# EAGLE design Eagle_Teensy3_6_TAF_BoardV2.2 (EAGLE 8.3.2)
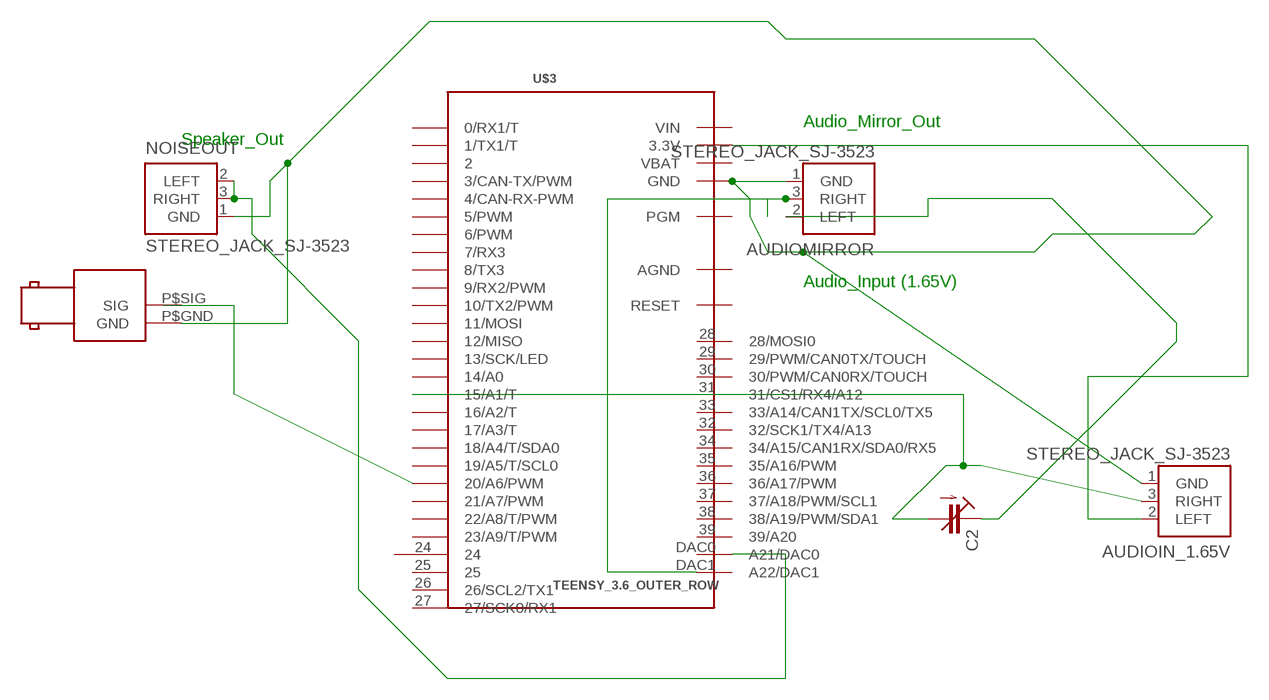
[diagram p0: schematic, sheet 1]

## Parts
AUDIOIN_1.65V  STEREO_JACK_SJ-3523  [SJ-3523]
AUDIOMIRROR  STEREO_JACK_SJ-3523  [SJ-3523]
C2  C-TRIMM3008  [3008]
NOISEOUT  STEREO_JACK_SJ-3523  [SJ-3523]
TTL  BNC_RIGHT_ANGLE  [BNC_RIGHT_ANGLE]
U$3  TEENSY_3.6_OUTER_ROW  [TEENSY3_6-OUTER_ROW]

## Nets
N$1: NOISEOUT.2(LEFT) NOISEOUT.3(RIGHT)
N$2: AUDIOIN_1.65V.1(GND) AUDIOMIRROR.1(GND) NOISEOUT.1(GND) TTL.P$GND(GND) U$3.3.3V2(GND) U$3.GND U$3.GND1(GND) U$3.GND2(GND)
N$3: AUDIOIN_1.65V.2(LEFT) U$3.3.3V U$3.3.3V1(3.3V)
N$5: AUDIOIN_1.65V.3(RIGHT) C2.-(A) U$3.15/A1(15/A1/T)
N$6: AUDIOMIRROR.3(RIGHT) U$3.DAC1(A22/DAC1)
N$8: AUDIOMIRROR.2(LEFT) C2.+(E)
Unconnected: TTL.P$SIG(SIG) U$3.0(0/RX1/T) U$3.1(1/TX1/T) U$3.2 U$3.3(3/CAN-TX/PWM) U$3.4(4/CAN-RX-PWM) U$3.5(5/PWM) U$3.6(6/PWM) U$3.7(7/RX3) U$3.8(8/TX3) U$3.9(9/RX2/PWM) U$3.10(10/TX2/PWM) U$3.11(11/MOSI) U$3.12(12/MISO) U$3.13(13/SCK/LED) U$3.14/A0 U$3.16/A2(16/A2/T) U$3.17/A3(17/A3/T) U$3.18/A4(18/A4/T/SDA0) U$3.19/A5(19/A5/T/SCL0) U$3.20/A6(20/A6/PWM) U$3.21/A7(21/A7/PWM) U$3.22/A8(22/A8/T/PWM) U$3.23/A9(23/A9/T/PWM) U$3.24 U$3.25 U$3.26(26/SCL2/TX1) U$3.27(27/SCK0/RX1) U$3.28(28/MOSI0) U$3.29(29/PWM/CAN0TX/TOUCH) U$3.30(30/PWM/CAN0RX/TOUCH) U$3.31(31/CS1/RX4/A12) U$3.32(32/SCK1/TX4/A13) U$3.33(33/A14/CAN1TX/SCL0/TX5) U$3.34(34/A15/CAN1RX/SDA0/RX5) U$3.35(35/A16/PWM) U$3.36(36/A17/PWM) U$3.37(37/A18/PWM/SCL1) U$3.38(38/A19/PWM/SDA1) U$3.39(39/A20) U$3.DAC0(A21/DAC0) U$3.PGM U$3.RESET

## Notes on the sheet
- Audio_Mirror_Out
- Speaker_Out
- Audio_Input (1.65V)

## Power pins joined to a net without a drawn wire
AGND: U$3.AGND
VBAT: U$3.VBAT
VIN: U$3.VIN

## Library data of the parts
AUDIOIN_1.65V AUDIOMIRROR NOISEOUT = RHD2000_eval_board:STEREO_JACK: CUI Inc. SJ-3523 stereo audio jack
C2 = c-trimm:C-TRIMM: Trimm capacitor; OC_FARNELL: unknown; OC_NEWARK: unknown
TTL = connectors:BNC_RIGHT_ANGLE: BNC plug, through-hole, right-angle
U$3 = Teensy3_6:TEENSY_3.6_OUTER_ROW: Footprint for Teensy 3.1 or 3.2 board using all pin connections on the outer perimeter

## Board
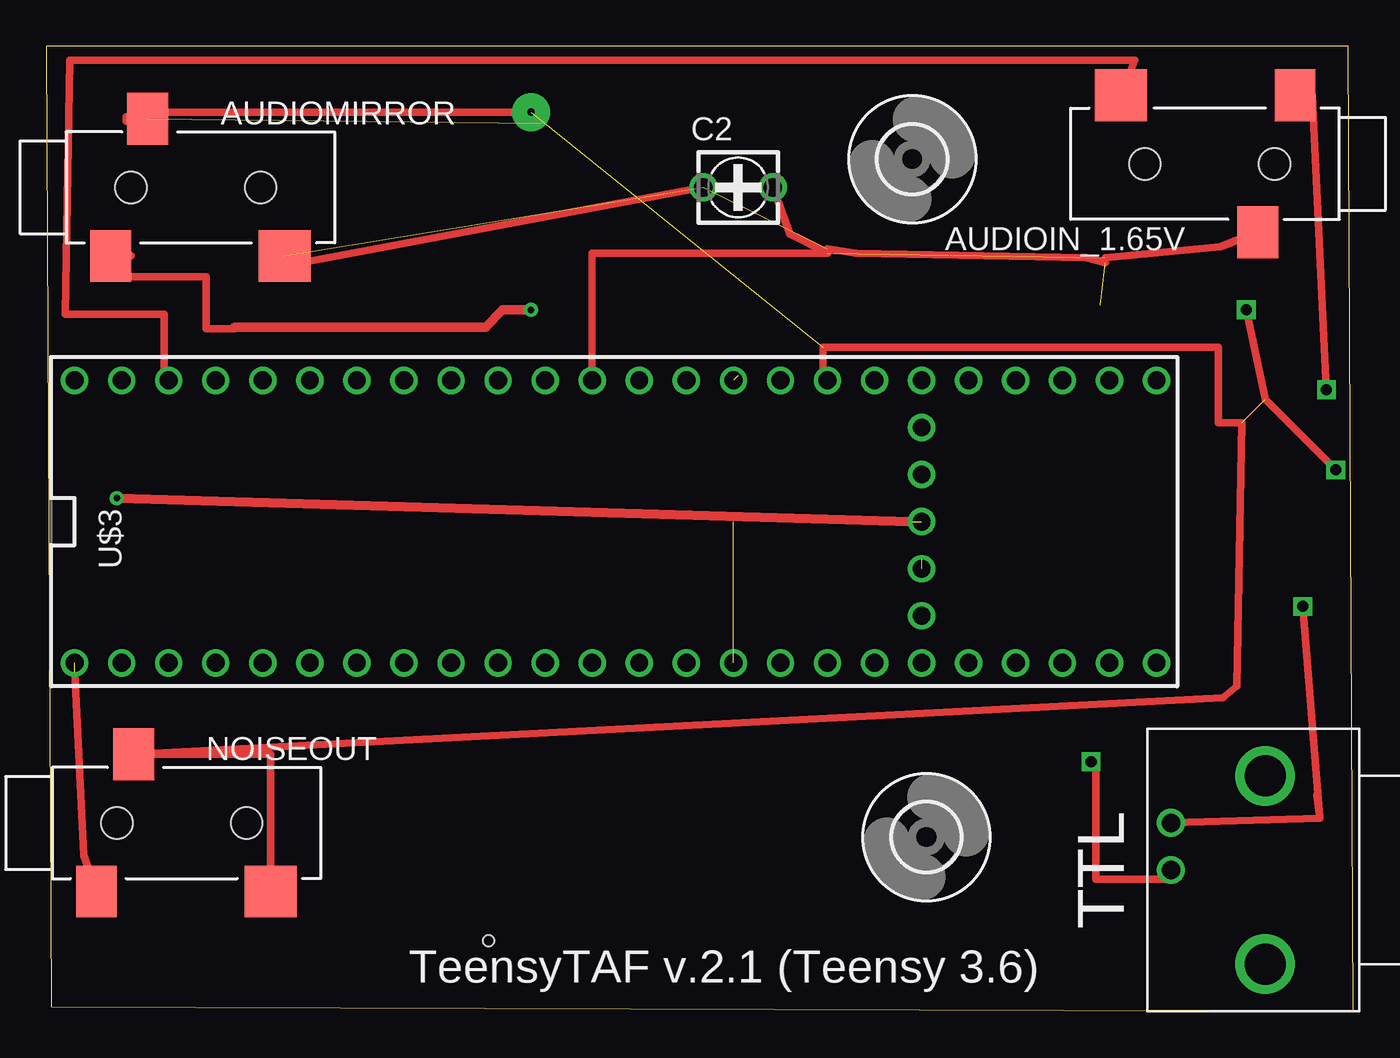
[diagram p1: board, top side]
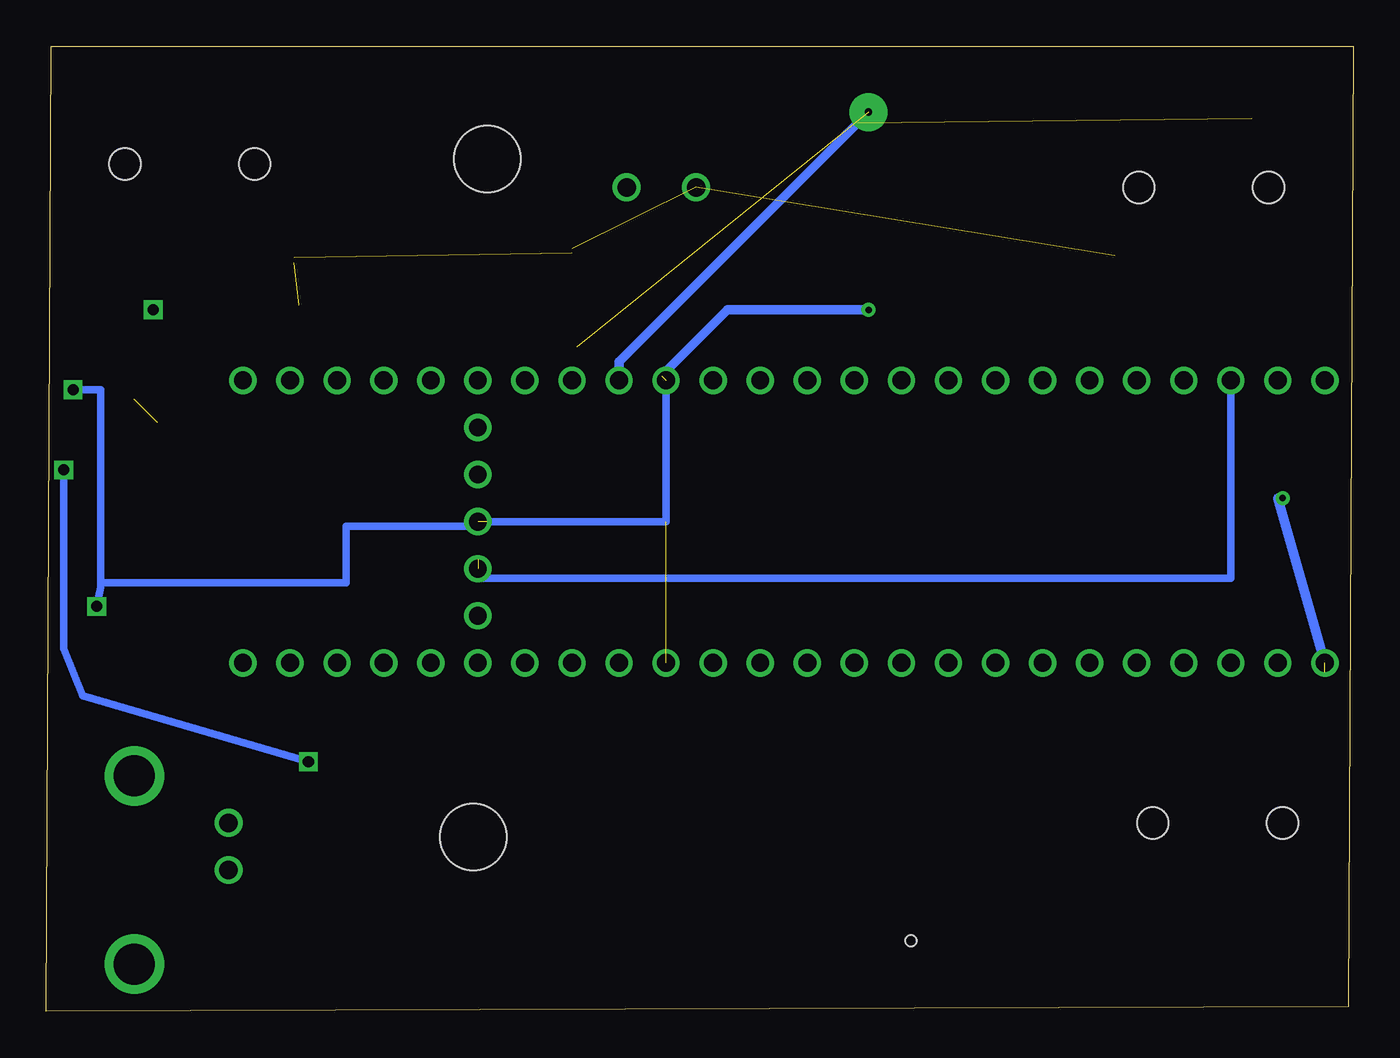
[diagram p2: board, bottom side, seen from below]

Size 70.54 x 52.06 mm. Coordinates in mm from the lower left corner, seen from the top.
Outline: 0.25,0.25 70.54,0 70.28,52.06 0,52.06 0.25,0.25
Copper layers (1*16): Top 0.035mm / dielectric 1.5mm / Bottom 0.035mm
Design rules "default": minimum track width 10mil, minimum drill 24mil, track to track 8mil, track to pad 8mil, pad to pad 8mil, via to via 8mil, smd to smd 8mil, copper to edge 40mil, drill to drill 8mil, minimum pad ring 10mil, minimum via ring 8mil, stop-mask expansion 4mil, vias tented up to drill 0mil, thermal gap 10mil
Holes 0.6 mm at 23.88,3.81 23.88,3.81 23.88,3.81

### Footprints (pad centres in the part's own frame; a part is rotated, then mirrored left to right if it is on the bottom)
SJ-3523 = smd 2.2 x 2.8: 1 -1.1,-3.7; 3 0.9,3.7 | smd 2.8 x 2.8: 2 8.3,-3.7 | hole 1.7: 7,0; 0,0
3008 = drill 1: + -1.875,0; - 1.875,0
BNC_RIGHT_ANGLE = drill 2.2: P$1 -5.08,-6.35; P$2 5.08,-6.35 | drill 1: P$GND -2.54,-11.43; P$SIG 0,-11.43
3,6 = hole 3.6: 0,0
TEENSY3_6-OUTER_ROW = drill 0.965: 0 -7.62,13.97; 1 -7.62,11.43; 2 -7.62,8.89; 3 -7.62,6.35; 3.3V 7.62,11.43; 3.3V1 -2.54,-29.21; 3.3V2 -7.62,-19.05; 4 -7.62,3.81; 5 -7.62,1.27; 6 -7.62,-1.27; 7 -7.62,-3.81; 8 -7.62,-6.35; 9 -7.62,-8.89; 10 -7.62,-11.43; 11 -7.62,-13.97; 12 -7.62,-16.51; 13 7.62,-16.51; 14/A0 7.62,-13.97; 15/A1 7.62,-11.43; 16/A2 7.62,-8.89; 17/A3 7.62,-6.35; 18/A4 7.62,-3.81; 19/A5 7.62,-1.27; 20/A6 7.62,1.27; 21/A7 7.62,3.81; 22/A8 7.62,6.35; 23/A9 7.62,8.89; 24 -7.62,-21.59; 25 -7.62,-24.13; 26 -7.62,-26.67; 27 -7.62,-29.21; 28 -7.62,-31.75; 29 -7.62,-34.29; 30 -7.62,-36.81; 31 -7.62,-39.35; 32 -7.62,-41.89; 33 7.62,-41.89; 34 7.62,-39.35; 35 7.62,-36.81; 36 7.62,-34.29; 37 7.62,-31.75; 38 7.62,-29.21; 39 7.62,-26.67; AGND 7.62,13.97; DAC0 7.62,-24.13; DAC1 7.62,-21.59; GND -7.62,16.51; GND1 0,-29.21; GND2 7.62,-19.05; PGM 2.54,-29.21; RESET 5.08,-29.21; VBAT -5.08,-29.21; VIN 7.62,16.51

### Placement (x,y rotation side)
AUDIOIN_1.65V  66.29,45.72 180 top
AUDIOMIRROR  4.57,44.45 0 top
C2  37.34,44.45 0 top
NOISEOUT  3.81,10.16 0 top
TTL  72.14,7.62 270 top
U$1  [3,6]  46.74,45.97 0 top
U$2  [3,6]  47.5,9.4 0 top
U$3  18.03,26.42 90 top

### Tracks (layer width: path | path; a pad name or v marks a point on that pad's centre or on a via)
N$1  (via drill 0.39 pad 2.06, 0.6)  (2 unrouted)
  Top 0.406: v69.6,29.21 65.79,33.02 v64.77,37.85 | v56.39,13.46 56.64,13.46 56.64,7.11 60.71,7.11 | 60.96,7.11 60.71,7.11 | 60.71,7.11 60.71,8.13 | 5.59,48.51 25.91,48.51 | 5.33,48.51 5.59,48.51 | 5.59,48.51 5.59,48.01 4.32,48.01 4.32,48.26 5.08,48.26 5.08,47.75 | 42.16,33.78 42.16,34.29 41.91,34.29 41.91,35.81 63.25,35.81 63.25,31.75 64.52,31.75 64.26,17.53 63.5,16.91 NOISEOUT.3 12.11,13.86 NOISEOUT.2
  Top 0.508: 25.91,48.51 v26.17,48.51
  Bottom 0.406: v56.39,13.46 68.58,17.02 69.6,19.56 v69.6,29.21
N$2  (via drill 0.35, 0.6)  (4 unrouted)
  Top 0.406: 68.58,11.68 68.74,10.44 | 68.74,10.44 v67.82,21.84 | 1.52,18.29 2.03,8.41 NOISEOUT.1 | TTL.P$GND 68.74,10.41 68.74,10.44 | AUDIOIN_1.65V.1 68.33,49.42 v69.09,33.53 | AUDIOMIRROR.1 4.06,40.75 | 4.06,40.75 4.57,40.75 | 10.16,36.91 10.16,36.83 8.64,36.83 8.64,39.62 4.06,39.62 4.06,40.75
  Top 0.508: 10.16,36.91 23.71,36.91 24.64,37.85 v26.16,37.85 | v3.81,27.69 46.74,26.42
  Bottom 0.406: v67.82,21.84 67.61,22.87 | 67.61,22.87 67.56,23.11 54.36,23.11 54.36,26.16 47.24,26.16 U$3.GND1 37.08,26.42 U$3.GND2 | v69.09,33.53 67.61,33.53 67.61,22.87
  Bottom 0.508: v26.16,37.85 33.78,37.85 37.34,34.29 | U$3.GND 4.06,27.69 v3.81,27.69
N$3  (1 unrouted)
  Top 0.406: U$3.3.3V 6.35,34.04 6.35,37.59 1.02,37.59 1.27,51.31 58.76,51.31 AUDIOIN_1.65V.2
  Bottom 0.406: U$3.3.3V 6.6,23.37 47.24,23.37 47.24,24.38
N$5  (1 unrouted)
  Top 0.406: AUDIOIN_1.65V.3 63.36,41.26 57.15,40.64 | C2.- 40.13,41.91 42.16,40.89 29.46,40.89 U$3.15/A1
N$6  (1 unrouted)
  Bottom 0.508: U$3.DAC1 39.62,35.05 26.76,47.92
N$8  (3 unrouted)
  Top 0.406: 57.15,40.39 56.13,40.64 43.69,40.89 42.16,41.15 | C2.+ 12.45,40.13

### Text on the board
tNames: TeensyTAF v.2.1 (Teensy 3.6)